# EAGLE design SolarSynth (EAGLE 7.2.0)
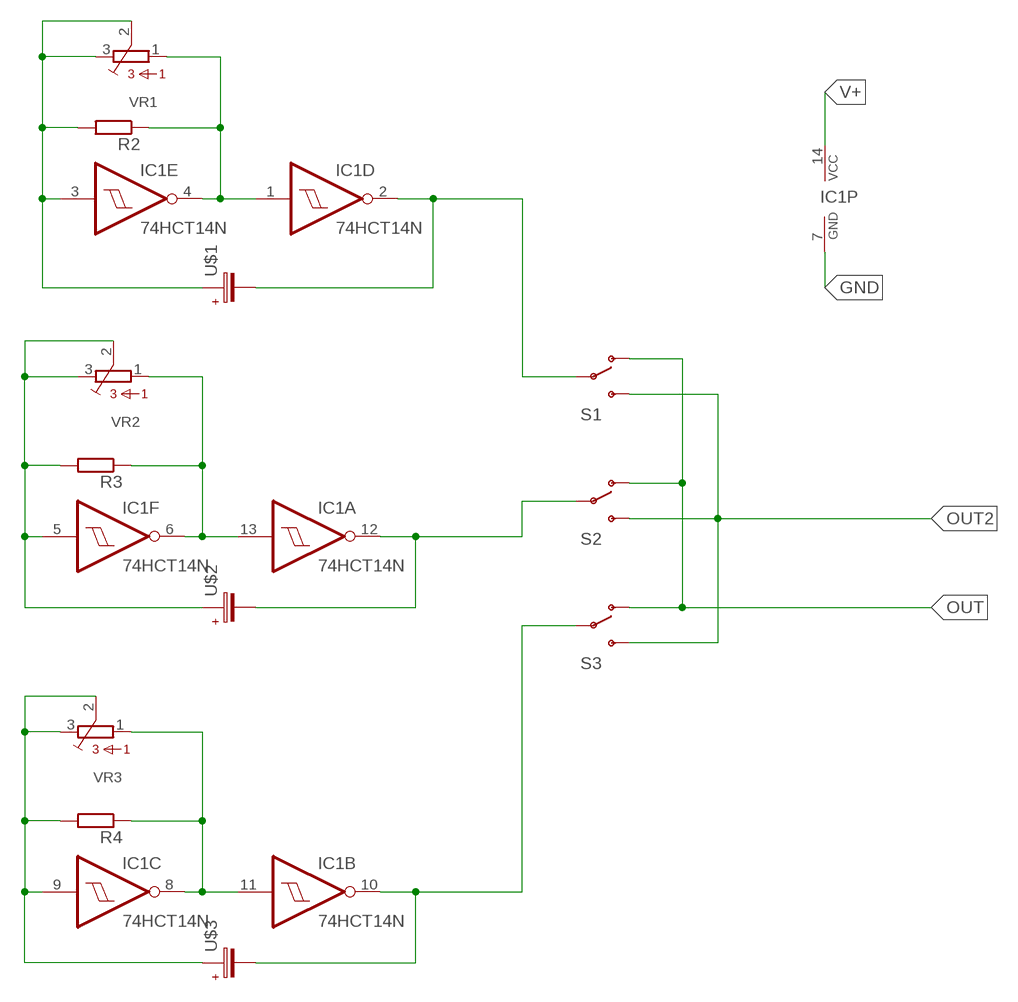
[diagram p0: schematic, sheet 1]

## Parts
IC1  74HCT14N  [DIL14]
R2  R-EU_0207/7  [0207/7]
R3  R-EU_0207/7  [0207/7]
R4  R-EU_0207/7  [0207/7]
S1  SWITCH-SPDTKIT  [SWITCH-SPDT_KIT]
S2  SWITCH-SPDTKIT  [SWITCH-SPDT_KIT]
S3  SWITCH-SPDTKIT  [SWITCH-SPDT_KIT]
U$1  080-EU  [080_025]
U$2  080-EU  [080_025]
U$3  080-EU  [080_025]
VR1  BOURNS_3362P_TRIMMERP  [BOURNS_3362P_TRIMMER]
VR2  BOURNS_3362P_TRIMMERP  [BOURNS_3362P_TRIMMER]
VR3  BOURNS_3362P_TRIMMERP  [BOURNS_3362P_TRIMMER]

## Nets
GND: IC1.7(P:GND)
N$4: IC1.1(D:I) IC1.4(E:O) R2.1 VR1.1
N$5: IC1.3(E:I) R2.2 U$1.+ VR1.2 VR1.3
N$6: IC1.2(D:O) S1.2(P) U$1.-
N$7: IC1.5(F:I) R3.2 U$2.+ VR2.2 VR2.3
N$8: IC1.6(F:O) IC1.13(A:I) R3.1 VR2.1
N$9: IC1.12(A:O) S2.2(P) U$2.-
N$10: IC1.9(C:I) R4.2 U$3.+ VR3.2 VR3.3
N$11: IC1.8(C:O) IC1.11(B:I) R4.1 VR3.1
N$12: IC1.10(B:O) S3.2(P) U$3.-
OUT: S1.1(O) S2.1(O) S3.1(O)
OUT2: S1.3(S) S2.3(S) S3.3(S)
V+: IC1.14(P:VCC)

## Library data of the parts
IC1 = 74xx-eu:74*14: Hex schmitt trigger INVERTER
R2-R4 = TomW:R-EU_: RESISTOR, European symbol
S1-S3 = SparkFun-Electromechanical:SWITCH-SPDT: SPDT Switch Simple slide switch, Spark Fun Electronics SKU : COM-00102 DPDT SMT slide switch, AYZ0202, SWCH-08179; PROD_ID: SWCH-08261
U$1-U$3 = gm-caps-electro-pol:080-EU
VR1-VR3 = MusicThingModular:BOURNS_3362P_TRIMMER: 3362 Series 1/4" Square Trimmer

## Board
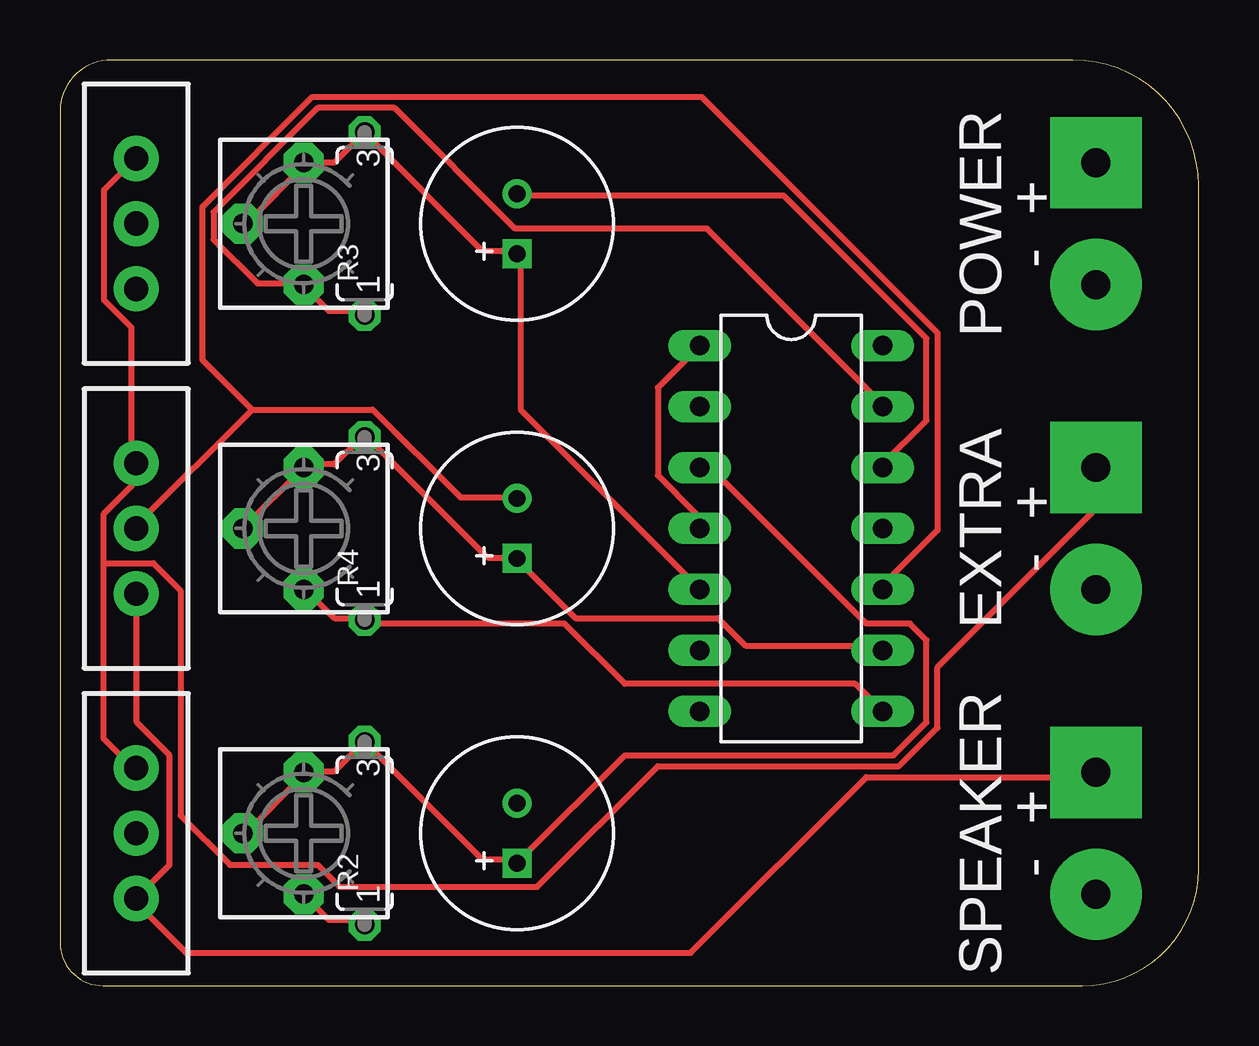
[diagram p1: board, top side]
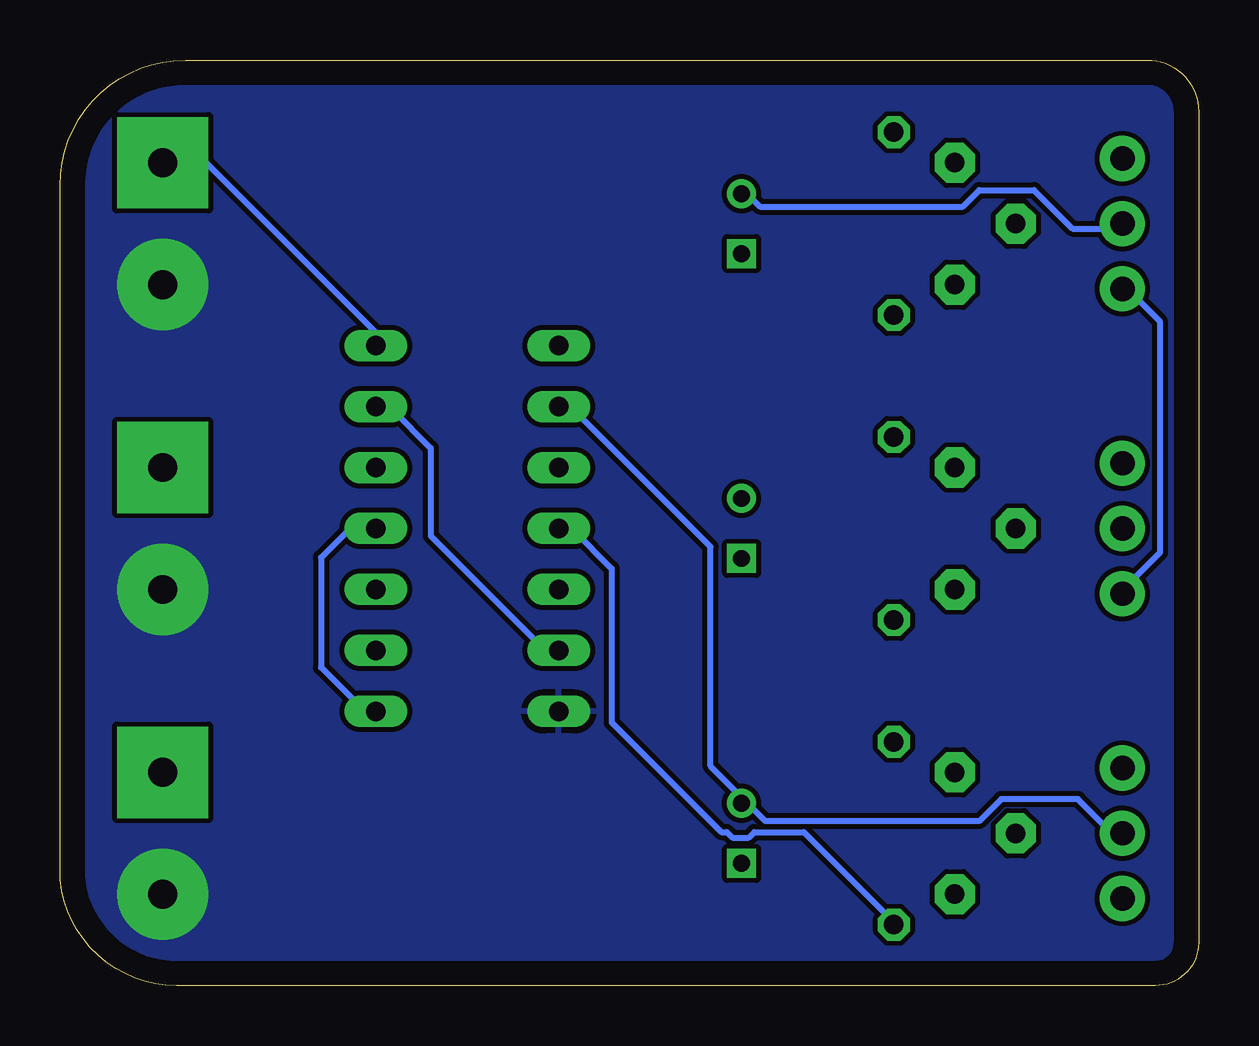
[diagram p2: board, bottom side, seen from below]

Size 47.46 x 38.57 mm. Coordinates in mm from the lower left corner, seen from the top.
Outline: 0,36.42 0,1.8 arc90 1.8,0 42.6,0 arc90 47.46,4.86 47.46,33.34 arc90 42.23,38.57 2.15,38.57 arc90 0,36.42
Copper layers (1*16): Top 0.035mm / dielectric 1.5mm / Bottom 0.035mm
Design rules "default *": minimum track width 10mil, minimum drill 24mil, track to track 8mil, track to pad 8mil, pad to pad 8mil, via to via 8mil, smd to smd 8mil, copper to edge 40mil, drill to drill 8mil, minimum pad ring 10mil, minimum via ring 8mil, stop-mask expansion 4mil, vias tented up to drill 0mil, thermal gap 10mil

### Footprints (pad centres in the part's own frame; a part is rotated, then mirrored left to right if it is on the bottom)
DIL14 = drill 0.813 long: 1 -7.62,-3.81; 2 -5.08,-3.81; 3 -2.54,-3.81; 4 0,-3.81; 5 2.54,-3.81; 6 5.08,-3.81; 7 7.62,-3.81; 8 7.62,3.81; 9 5.08,3.81; 10 2.54,3.81; 11 0,3.81; 12 -2.54,3.81; 13 -5.08,3.81; 14 -7.62,3.81
0207/7 = drill 0.813 octagon: 1 -3.81,0; 2 3.81,0
SWITCH-SPDT_KIT = drill 1.016 pad 1.88: 1 0,2.718; 2 0,0; 3 0,-2.718
080_025 = drill 0.7 square: + -1.25,0 | drill 0.7: - 1.25,0
BOURNS_3362P_TRIMMER = drill 0.813 pad 1.676 octagon: 1 -2.54,0; 2 0,2.54; 3 2.54,0

### Placement (x,y rotation side)
IC1  30.48,19.05 270 top
R2  12.7,6.35 90 top
R3  12.7,31.75 90 top
R4  12.7,19.05 90 top
S1  3.17,6.35 0 top
S2  3.17,31.75 0 top
S3  3.17,19.05 0 top
U$1  19.05,6.35 90 top
U$2  19.05,31.75 90 top
U$3  19.05,19.05 90 top
U$4  [MTM_1CM_KEEPOUT]  31.75,36.83 270 bottom
VR1  10.16,6.35 90 top
VR2  10.16,31.75 90 top
VR3  10.16,19.05 90 top

### Tracks (layer width: path | path; a pad name or v marks a point on that pad's centre or on a via)
GND  (via drill 1.2 pad 3.81)
  other vias: 43.18,3.81 43.18,29.21 43.18,16.51
  pour Bottom: 0,39.37 48.26,39.37 48.26,-3.81 0,-3.81
N$4
  Top 0.254: R2.1 12.57,2.74 11.2,2.74 10.29,3.66 VR1.1 | IC1.1 24.92,24.92 24.92,21.26 26.52,19.66 26.52,19.2 IC1.4
  Bottom 0.254: R2.1 12.8,2.74 16.46,6.4 18.52,6.4 18.75,6.17 19.43,6.17 19.66,6.4 19.89,6.4 24.46,10.97 24.46,17.37 26.06,18.97 26.52,18.97 IC1.4
N$5
  Top 0.254: VR1.2 7.77,6.4 10.06,8.69 VR1.3 10.29,8.91 11.43,8.91 12.57,10.06 R2.2 17.6,5.26 18.97,5.26 U$1.+ 19.2,5.26 23.55,9.6 34.75,9.6 36.12,10.97 36.12,14.4 35.43,15.09 33.6,15.09 27.2,21.49 26.75,21.49 IC1.3
N$6
  Bottom 0.254: S1.2 3.2,6.4 3.66,6.4 5.03,7.77 8.23,7.77 9.14,6.86 18.06,6.86 18.75,7.54 18.97,7.54 U$1.- 18.97,7.77 20.34,9.14 20.34,18.29 26.06,24 26.52,24 IC1.2
N$7
  Top 0.254: 10.29,34.29 7.77,31.77 VR2.2 | IC1.5 26.52,16.69 19.2,24 19.2,30.4 U$2.+ 18.97,30.63 17.6,30.63 12.8,35.43 R3.2 11.43,34.29 10.29,34.29 | 10.29,34.29 VR2.3
N$8
  Top 0.254: R3.1 12.57,28.12 11.2,28.12 10.29,29.03 VR2.1 10.06,29.26 8.23,29.26 6.4,31.09 6.4,32.23 10.74,36.58 13.95,36.58 18.97,31.55 26.98,31.55 34.29,24.23 IC1.13
  Bottom 0.254: IC1.6 26.75,14.17 27.43,14.17 32,18.75 32,22.4 33.6,24 34.29,24 IC1.13
N$9
  Top 0.254: U$2.- 19.2,32.92 30.18,32.92 36.12,26.98 36.12,23.55 34.29,21.72 IC1.12
  Bottom 0.254: S2.2 3.2,31.55 5.26,31.55 6.86,33.15 9.14,33.15 9.83,32.46 18.29,32.46 18.97,33.15 U$2.-
N$10
  Top 0.254: VR3.2 VR3.3 10.29,21.72 11.43,21.72 12.57,22.86 R4.2 12.8,22.86 17.83,17.83 18.97,17.83 U$3.+ 19.2,17.6 21.49,15.32 27.43,15.32 28.57,14.17 34.29,14.17 IC1.9
N$11
  Top 0.254: VR3.1 10.29,16.46 11.43,15.32 12.57,15.32 R4.1 12.8,15.09 21.03,15.09 23.55,12.57 33.15,12.57 IC1.8
  Bottom 0.254: IC1.8 34.75,11.43 36.58,13.26 36.58,17.83 35.43,18.97 34.29,18.97 IC1.11
N$12
  Top 0.254: 8,24 13.03,24 16.69,20.34 18.97,20.34 U$3.- | 8,24 3.2,19.2 S3.2 | 8,24 5.94,26.06 5.94,32.46 10.52,37.03 26.75,37.03 36.58,27.2 36.58,18.97 34.29,16.69 IC1.10
OUT  (via drill 1.2 pad 3.81)
  Top 0.254: S2.1 2.97,34.29 1.83,33.15 1.83,28.57 2.97,27.43 2.97,21.95 S3.1 2.97,21.72 2.97,20.8 1.83,19.66 1.83,17.6 | 1.83,17.6 1.83,10.29 2.97,9.14 S1.1 | 1.83,17.6 3.89,17.6 5.03,16.46 5.03,7.09 7.09,5.03 10.74,5.03 11.66,4.12 19.89,4.12 24.92,9.14 34.98,9.14 36.58,10.74 36.58,13.26 42.98,19.66 42.98,21.49 v43.18,21.59
OUT2  (via drill 1.2 pad 3.81)
  Top 0.254: v43.18,8.89 42.98,8.69 33.6,8.69 26.29,1.37 5.26,1.37 3.2,3.43 S1.3 4.57,5.03 4.57,9.6 3.2,10.97 3.2,16.23 S3.3
  Bottom 0.254: S2.3 2.97,29.03 1.6,27.66 1.6,18.06 3.2,16.46 S3.3
V+  (via drill 1.2 pad 3.81)
  Top 0.254: 34.29,26.75 IC1.14 | 42.98,32.92 v43.18,34.29
  Bottom 0.254: v43.18,34.29 41.38,34.29 34.29,27.2 IC1.14

### Text on the board
tPlace: POWER / - + | EXTRA / - + | SPEAKER / - +